# EAGLE board gmatrix (EAGLE 9.6.0)
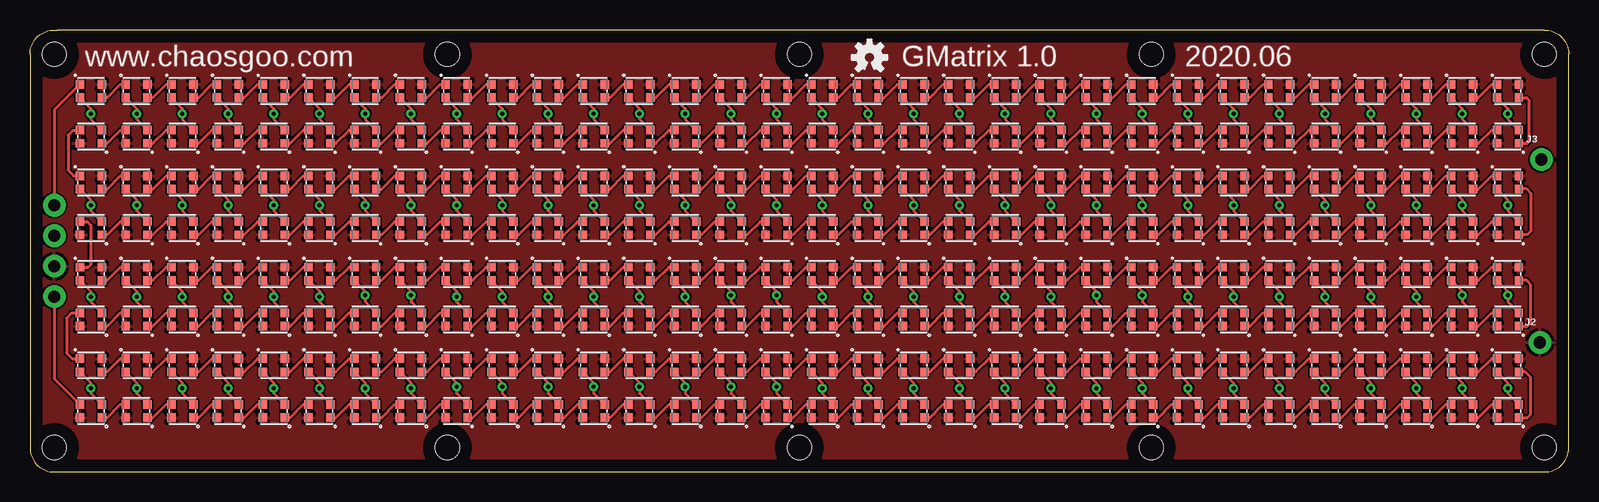
[diagram p3: board, top side]
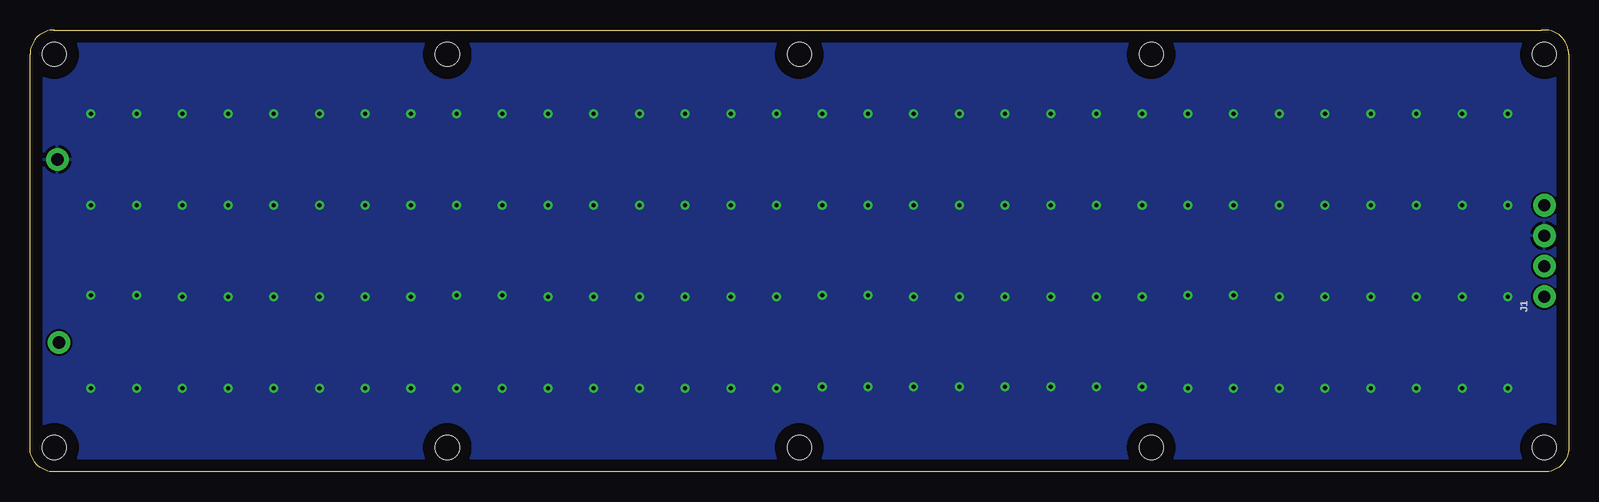
[diagram p4: board, bottom side, seen from below]

Size 128.27 x 36.83 mm. Coordinates in mm from the lower left corner, seen from the top.
Outline: 2.29,0 126.24,0 arc90 128.27,2.03 128.27,34.8 arc90 126.24,36.83 2.29,36.83 2.03,36.83 arc90 0,34.8 0,2.03 arc90 2.03,0 2.29,0
Copper layers (1*16): Top 0.035mm / dielectric 1.5mm / Bottom 0.035mm
Design rules "default": minimum track width 6mil, minimum drill 0.35mm, track to track 6mil, track to pad 6mil, pad to pad 6mil, via to via 6mil, smd to smd 6mil, copper to edge 40mil, drill to drill 6mil, minimum pad ring 10mil, minimum via ring 8mil, stop-mask expansion 4mil, vias tented up to drill 0mil, thermal gap 10mil
Holes 2 mm at 2.03,34.8 2.03,2.03 126.24,34.8 126.24,2.03 64.14,34.8 64.14,2.03 34.8,2.03 34.8,34.8 93.47,34.8 93.47,2.03

## Footprints (pad centres in the part's own frame; a part is rotated, then mirrored left to right if it is on the bottom)
1X04_NO_SILK = drill 1.016 pad 1.88: 1 0,0; 2 2.54,0; 3 5.08,0; 4 7.62,0
1X01NS_KIT = drill 1.016 pad 1.88: 1 0,0
WS2812-2020 = smd 0.7 x 0.7: 1 0.915,-0.55; 2 0.915,0.55; 3 -0.915,0.55; 4 -0.915,-0.55

## Placement (x,y rotation side)
J1  [1X04_NO_SILK]  2.03,14.61 90 bottom
J2  [1X01NS_KIT]  125.86,10.79 0 top
J3  [1X01NS_KIT]  125.98,26.04 0 top
U$1  WS2812-2020  [WS2812-2020]  5.08,5.08 0 top
U$2  WS2812-2020  [WS2812-2020]  8.89,5.08 0 top
U$3  WS2812-2020  [WS2812-2020]  12.7,5.08 0 top
U$4  WS2812-2020  [WS2812-2020]  16.51,5.08 0 top
U$5  WS2812-2020  [WS2812-2020]  20.32,5.08 0 top
U$6  WS2812-2020  [WS2812-2020]  24.13,5.08 0 top
U$7  WS2812-2020  [WS2812-2020]  27.94,5.08 0 top
U$8  WS2812-2020  [WS2812-2020]  31.75,5.08 0 top
U$9  WS2812-2020  [WS2812-2020]  35.56,5.08 0 top
U$10  WS2812-2020  [WS2812-2020]  39.37,5.08 0 top
U$11  WS2812-2020  [WS2812-2020]  43.18,5.08 0 top
U$12  WS2812-2020  [WS2812-2020]  46.99,5.08 0 top
U$13  WS2812-2020  [WS2812-2020]  50.8,5.08 0 top
U$14  WS2812-2020  [WS2812-2020]  54.61,5.08 0 top
U$15  WS2812-2020  [WS2812-2020]  58.42,5.08 0 top
U$16  WS2812-2020  [WS2812-2020]  62.23,5.08 0 top
U$17  WS2812-2020  [WS2812-2020]  66.04,5.08 0 top
U$18  WS2812-2020  [WS2812-2020]  69.85,5.08 0 top
U$19  WS2812-2020  [WS2812-2020]  73.66,5.08 0 top
U$20  WS2812-2020  [WS2812-2020]  77.47,5.08 0 top
U$21  WS2812-2020  [WS2812-2020]  81.28,5.08 0 top
U$22  WS2812-2020  [WS2812-2020]  85.09,5.08 0 top
U$23  WS2812-2020  [WS2812-2020]  88.9,5.08 0 top
U$24  WS2812-2020  [WS2812-2020]  92.71,5.08 0 top
U$25  WS2812-2020  [WS2812-2020]  96.52,5.08 0 top
U$26  WS2812-2020  [WS2812-2020]  100.33,5.08 0 top
U$27  WS2812-2020  [WS2812-2020]  104.14,5.08 0 top
U$28  WS2812-2020  [WS2812-2020]  107.95,5.08 0 top
U$29  WS2812-2020  [WS2812-2020]  111.76,5.08 0 top
U$30  WS2812-2020  [WS2812-2020]  115.57,5.08 0 top
U$31  WS2812-2020  [WS2812-2020]  119.38,5.08 0 top
U$32  WS2812-2020  [WS2812-2020]  123.19,5.08 0 top
U$33  WS2812-2020  [WS2812-2020]  123.19,8.89 180 top
U$34  WS2812-2020  [WS2812-2020]  119.38,8.89 180 top
U$35  WS2812-2020  [WS2812-2020]  115.57,8.89 180 top
U$36  WS2812-2020  [WS2812-2020]  111.76,8.89 180 top
U$37  WS2812-2020  [WS2812-2020]  107.95,8.89 180 top
U$38  WS2812-2020  [WS2812-2020]  104.14,8.89 180 top
U$39  WS2812-2020  [WS2812-2020]  100.33,8.89 180 top
U$40  WS2812-2020  [WS2812-2020]  96.52,8.89 180 top
U$41  WS2812-2020  [WS2812-2020]  92.71,8.89 180 top
U$42  WS2812-2020  [WS2812-2020]  88.9,8.89 180 top
U$43  WS2812-2020  [WS2812-2020]  85.09,8.89 180 top
U$44  WS2812-2020  [WS2812-2020]  81.28,8.89 180 top
U$45  WS2812-2020  [WS2812-2020]  77.47,8.89 180 top
U$46  WS2812-2020  [WS2812-2020]  73.66,8.89 180 top
U$47  WS2812-2020  [WS2812-2020]  69.85,8.89 180 top
U$48  WS2812-2020  [WS2812-2020]  66.04,8.89 180 top
U$49  WS2812-2020  [WS2812-2020]  62.23,8.89 180 top
U$50  WS2812-2020  [WS2812-2020]  58.42,8.89 180 top
U$51  WS2812-2020  [WS2812-2020]  54.61,8.89 180 top
U$52  WS2812-2020  [WS2812-2020]  50.8,8.89 180 top
U$53  WS2812-2020  [WS2812-2020]  46.99,8.89 180 top
U$54  WS2812-2020  [WS2812-2020]  43.18,8.89 180 top
U$55  WS2812-2020  [WS2812-2020]  39.37,8.89 180 top
U$56  WS2812-2020  [WS2812-2020]  35.56,8.89 180 top
U$57  WS2812-2020  [WS2812-2020]  31.75,8.89 180 top
U$58  WS2812-2020  [WS2812-2020]  27.94,8.89 180 top
U$59  WS2812-2020  [WS2812-2020]  24.13,8.89 180 top
U$60  WS2812-2020  [WS2812-2020]  20.32,8.89 180 top
U$61  WS2812-2020  [WS2812-2020]  16.51,8.89 180 top
U$62  WS2812-2020  [WS2812-2020]  12.7,8.89 180 top
U$63  WS2812-2020  [WS2812-2020]  8.89,8.89 180 top
U$64  WS2812-2020  [WS2812-2020]  5.08,8.89 180 top
U$65  WS2812-2020  [WS2812-2020]  5.08,12.7 0 top
U$66  WS2812-2020  [WS2812-2020]  8.89,12.7 0 top
U$67  WS2812-2020  [WS2812-2020]  12.7,12.7 0 top
U$68  WS2812-2020  [WS2812-2020]  16.51,12.7 0 top
U$69  WS2812-2020  [WS2812-2020]  20.32,12.7 0 top
U$70  WS2812-2020  [WS2812-2020]  24.13,12.7 0 top
U$71  WS2812-2020  [WS2812-2020]  27.94,12.7 0 top
U$72  WS2812-2020  [WS2812-2020]  31.75,12.7 0 top
U$73  WS2812-2020  [WS2812-2020]  35.56,12.7 0 top
U$74  WS2812-2020  [WS2812-2020]  39.37,12.7 0 top
U$75  WS2812-2020  [WS2812-2020]  43.18,12.7 0 top
U$76  WS2812-2020  [WS2812-2020]  46.99,12.7 0 top
U$77  WS2812-2020  [WS2812-2020]  50.8,12.7 0 top
U$78  WS2812-2020  [WS2812-2020]  54.61,12.7 0 top
U$79  WS2812-2020  [WS2812-2020]  58.42,12.7 0 top
U$80  WS2812-2020  [WS2812-2020]  62.23,12.7 0 top
U$81  WS2812-2020  [WS2812-2020]  66.04,12.7 0 top
U$82  WS2812-2020  [WS2812-2020]  69.85,12.7 0 top
U$83  WS2812-2020  [WS2812-2020]  73.66,12.7 0 top
U$84  WS2812-2020  [WS2812-2020]  77.47,12.7 0 top
U$85  WS2812-2020  [WS2812-2020]  81.28,12.7 0 top
U$86  WS2812-2020  [WS2812-2020]  85.09,12.7 0 top
U$87  WS2812-2020  [WS2812-2020]  88.9,12.7 0 top
U$88  WS2812-2020  [WS2812-2020]  92.71,12.7 0 top
U$89  WS2812-2020  [WS2812-2020]  96.52,12.7 0 top
U$90  WS2812-2020  [WS2812-2020]  100.33,12.7 0 top
U$91  WS2812-2020  [WS2812-2020]  104.14,12.7 0 top
U$92  WS2812-2020  [WS2812-2020]  107.95,12.7 0 top
U$93  WS2812-2020  [WS2812-2020]  111.76,12.7 0 top
U$94  WS2812-2020  [WS2812-2020]  115.57,12.7 0 top
U$95  WS2812-2020  [WS2812-2020]  119.38,12.7 0 top
U$96  WS2812-2020  [WS2812-2020]  123.19,12.7 0 top
U$97  WS2812-2020  [WS2812-2020]  123.19,16.51 180 top
U$98  WS2812-2020  [WS2812-2020]  119.38,16.51 180 top
U$99  WS2812-2020  [WS2812-2020]  115.57,16.51 180 top
U$100  WS2812-2020  [WS2812-2020]  111.76,16.51 180 top
U$101  WS2812-2020  [WS2812-2020]  107.95,16.51 180 top
U$102  WS2812-2020  [WS2812-2020]  104.14,16.51 180 top
U$103  WS2812-2020  [WS2812-2020]  100.33,16.51 180 top
U$104  WS2812-2020  [WS2812-2020]  96.52,16.51 180 top
U$105  WS2812-2020  [WS2812-2020]  92.71,16.51 180 top
U$106  WS2812-2020  [WS2812-2020]  88.9,16.51 180 top
U$107  WS2812-2020  [WS2812-2020]  85.09,16.51 180 top
U$108  WS2812-2020  [WS2812-2020]  81.28,16.51 180 top
U$109  WS2812-2020  [WS2812-2020]  77.47,16.51 180 top
U$110  WS2812-2020  [WS2812-2020]  73.66,16.51 180 top
U$111  WS2812-2020  [WS2812-2020]  69.85,16.51 180 top
U$112  WS2812-2020  [WS2812-2020]  66.04,16.51 180 top
U$113  WS2812-2020  [WS2812-2020]  62.23,16.51 180 top
U$114  WS2812-2020  [WS2812-2020]  58.42,16.51 180 top
U$115  WS2812-2020  [WS2812-2020]  54.61,16.51 180 top
U$116  WS2812-2020  [WS2812-2020]  50.8,16.51 180 top
U$117  WS2812-2020  [WS2812-2020]  46.99,16.51 180 top
U$118  WS2812-2020  [WS2812-2020]  43.18,16.51 180 top
U$119  WS2812-2020  [WS2812-2020]  39.37,16.51 180 top
U$120  WS2812-2020  [WS2812-2020]  35.56,16.51 180 top
U$121  WS2812-2020  [WS2812-2020]  31.75,16.51 180 top
U$122  WS2812-2020  [WS2812-2020]  27.94,16.51 180 top
U$123  WS2812-2020  [WS2812-2020]  24.13,16.51 180 top
U$124  WS2812-2020  [WS2812-2020]  20.32,16.51 180 top
U$125  WS2812-2020  [WS2812-2020]  16.51,16.51 180 top
U$126  WS2812-2020  [WS2812-2020]  12.7,16.51 180 top
U$127  WS2812-2020  [WS2812-2020]  8.89,16.51 180 top
U$128  WS2812-2020  [WS2812-2020]  5.08,16.51 180 top
U$129  WS2812-2020  [WS2812-2020]  5.08,20.32 0 top
U$130  WS2812-2020  [WS2812-2020]  8.89,20.32 0 top
U$131  WS2812-2020  [WS2812-2020]  12.7,20.32 0 top
U$132  WS2812-2020  [WS2812-2020]  16.51,20.32 0 top
U$133  WS2812-2020  [WS2812-2020]  20.32,20.32 0 top
U$134  WS2812-2020  [WS2812-2020]  24.13,20.32 0 top
U$135  WS2812-2020  [WS2812-2020]  27.94,20.32 0 top
U$136  WS2812-2020  [WS2812-2020]  31.75,20.32 0 top
U$137  WS2812-2020  [WS2812-2020]  35.56,20.32 0 top
U$138  WS2812-2020  [WS2812-2020]  39.37,20.32 0 top
U$139  WS2812-2020  [WS2812-2020]  43.18,20.32 0 top
U$140  WS2812-2020  [WS2812-2020]  46.99,20.32 0 top
U$141  WS2812-2020  [WS2812-2020]  50.8,20.32 0 top
U$142  WS2812-2020  [WS2812-2020]  54.61,20.32 0 top
U$143  WS2812-2020  [WS2812-2020]  58.42,20.32 0 top
U$144  WS2812-2020  [WS2812-2020]  62.23,20.32 0 top
U$145  WS2812-2020  [WS2812-2020]  66.04,20.32 0 top
U$146  WS2812-2020  [WS2812-2020]  69.85,20.32 0 top
U$147  WS2812-2020  [WS2812-2020]  73.66,20.32 0 top
U$148  WS2812-2020  [WS2812-2020]  77.47,20.32 0 top
U$149  WS2812-2020  [WS2812-2020]  81.28,20.32 0 top
U$150  WS2812-2020  [WS2812-2020]  85.09,20.32 0 top
U$151  WS2812-2020  [WS2812-2020]  88.9,20.32 0 top
U$152  WS2812-2020  [WS2812-2020]  92.71,20.32 0 top
U$153  WS2812-2020  [WS2812-2020]  96.52,20.32 0 top
U$154  WS2812-2020  [WS2812-2020]  100.33,20.32 0 top
U$155  WS2812-2020  [WS2812-2020]  104.14,20.32 0 top
U$156  WS2812-2020  [WS2812-2020]  107.95,20.32 0 top
U$157  WS2812-2020  [WS2812-2020]  111.76,20.32 0 top
U$158  WS2812-2020  [WS2812-2020]  115.57,20.32 0 top
U$159  WS2812-2020  [WS2812-2020]  119.38,20.32 0 top
U$160  WS2812-2020  [WS2812-2020]  123.19,20.32 0 top
U$161  WS2812-2020  [WS2812-2020]  123.19,24.13 180 top
U$162  WS2812-2020  [WS2812-2020]  119.38,24.13 180 top
U$163  WS2812-2020  [WS2812-2020]  115.57,24.13 180 top
U$164  WS2812-2020  [WS2812-2020]  111.76,24.13 180 top
U$165  WS2812-2020  [WS2812-2020]  107.95,24.13 180 top
U$166  WS2812-2020  [WS2812-2020]  104.14,24.13 180 top
U$167  WS2812-2020  [WS2812-2020]  100.33,24.13 180 top
U$168  WS2812-2020  [WS2812-2020]  96.52,24.13 180 top
U$169  WS2812-2020  [WS2812-2020]  92.71,24.13 180 top
U$170  WS2812-2020  [WS2812-2020]  88.9,24.13 180 top
U$171  WS2812-2020  [WS2812-2020]  85.09,24.13 180 top
U$172  WS2812-2020  [WS2812-2020]  81.28,24.13 180 top
U$173  WS2812-2020  [WS2812-2020]  77.47,24.13 180 top
U$174  WS2812-2020  [WS2812-2020]  73.66,24.13 180 top
U$175  WS2812-2020  [WS2812-2020]  69.85,24.13 180 top
U$176  WS2812-2020  [WS2812-2020]  66.04,24.13 180 top
U$177  WS2812-2020  [WS2812-2020]  62.23,24.13 180 top
U$178  WS2812-2020  [WS2812-2020]  58.42,24.13 180 top
U$179  WS2812-2020  [WS2812-2020]  54.61,24.13 180 top
U$180  WS2812-2020  [WS2812-2020]  50.8,24.13 180 top
U$181  WS2812-2020  [WS2812-2020]  46.99,24.13 180 top
U$182  WS2812-2020  [WS2812-2020]  43.18,24.13 180 top
U$183  WS2812-2020  [WS2812-2020]  39.37,24.13 180 top
U$184  WS2812-2020  [WS2812-2020]  35.56,24.13 180 top
U$185  WS2812-2020  [WS2812-2020]  31.75,24.13 180 top
U$186  WS2812-2020  [WS2812-2020]  27.94,24.13 180 top
U$187  WS2812-2020  [WS2812-2020]  24.13,24.13 180 top
U$188  WS2812-2020  [WS2812-2020]  20.32,24.13 180 top
U$189  WS2812-2020  [WS2812-2020]  16.51,24.13 180 top
U$190  WS2812-2020  [WS2812-2020]  12.7,24.13 180 top
U$191  WS2812-2020  [WS2812-2020]  8.89,24.13 180 top
U$192  WS2812-2020  [WS2812-2020]  5.08,24.13 180 top
U$193  WS2812-2020  [WS2812-2020]  5.08,27.94 0 top
U$194  WS2812-2020  [WS2812-2020]  8.89,27.94 0 top
U$195  WS2812-2020  [WS2812-2020]  12.7,27.94 0 top
U$196  WS2812-2020  [WS2812-2020]  16.51,27.94 0 top
U$197  WS2812-2020  [WS2812-2020]  20.32,27.94 0 top
U$198  WS2812-2020  [WS2812-2020]  24.13,27.94 0 top
U$199  WS2812-2020  [WS2812-2020]  27.94,27.94 0 top
U$200  WS2812-2020  [WS2812-2020]  31.75,27.94 0 top
U$201  WS2812-2020  [WS2812-2020]  35.56,27.94 0 top
U$202  WS2812-2020  [WS2812-2020]  39.37,27.94 0 top
U$203  WS2812-2020  [WS2812-2020]  43.18,27.94 0 top
U$204  WS2812-2020  [WS2812-2020]  46.99,27.94 0 top
U$205  WS2812-2020  [WS2812-2020]  50.8,27.94 0 top
U$206  WS2812-2020  [WS2812-2020]  54.61,27.94 0 top
U$207  WS2812-2020  [WS2812-2020]  58.42,27.94 0 top
U$208  WS2812-2020  [WS2812-2020]  62.23,27.94 0 top
U$209  WS2812-2020  [WS2812-2020]  66.04,27.94 0 top
U$210  WS2812-2020  [WS2812-2020]  69.85,27.94 0 top
U$211  WS2812-2020  [WS2812-2020]  73.66,27.94 0 top
U$212  WS2812-2020  [WS2812-2020]  77.47,27.94 0 top
U$213  WS2812-2020  [WS2812-2020]  81.28,27.94 0 top
U$214  WS2812-2020  [WS2812-2020]  85.09,27.94 0 top
U$215  WS2812-2020  [WS2812-2020]  88.9,27.94 0 top
U$216  WS2812-2020  [WS2812-2020]  92.71,27.94 0 top
U$217  WS2812-2020  [WS2812-2020]  96.52,27.94 0 top
U$218  WS2812-2020  [WS2812-2020]  100.33,27.94 0 top
U$219  WS2812-2020  [WS2812-2020]  104.14,27.94 0 top
U$220  WS2812-2020  [WS2812-2020]  107.95,27.94 0 top
U$221  WS2812-2020  [WS2812-2020]  111.76,27.94 0 top
U$222  WS2812-2020  [WS2812-2020]  115.57,27.94 0 top
U$223  WS2812-2020  [WS2812-2020]  119.38,27.94 0 top
U$224  WS2812-2020  [WS2812-2020]  123.19,27.94 0 top
U$225  WS2812-2020  [WS2812-2020]  123.19,31.75 180 top
U$226  WS2812-2020  [WS2812-2020]  119.38,31.75 180 top
U$227  WS2812-2020  [WS2812-2020]  115.57,31.75 180 top
U$228  WS2812-2020  [WS2812-2020]  111.76,31.75 180 top
U$229  WS2812-2020  [WS2812-2020]  107.95,31.75 180 top
U$230  WS2812-2020  [WS2812-2020]  104.14,31.75 180 top
U$231  WS2812-2020  [WS2812-2020]  100.33,31.75 180 top
U$232  WS2812-2020  [WS2812-2020]  96.52,31.75 180 top
U$233  WS2812-2020  [WS2812-2020]  92.71,31.75 180 top
U$234  WS2812-2020  [WS2812-2020]  88.9,31.75 180 top
U$235  WS2812-2020  [WS2812-2020]  85.09,31.75 180 top
U$236  WS2812-2020  [WS2812-2020]  81.28,31.75 180 top
U$237  WS2812-2020  [WS2812-2020]  77.47,31.75 180 top
U$238  WS2812-2020  [WS2812-2020]  73.66,31.75 180 top
U$239  WS2812-2020  [WS2812-2020]  69.85,31.75 180 top
U$240  WS2812-2020  [WS2812-2020]  66.04,31.75 180 top
U$241  WS2812-2020  [WS2812-2020]  62.23,31.75 180 top
U$242  WS2812-2020  [WS2812-2020]  58.42,31.75 180 top
U$243  WS2812-2020  [WS2812-2020]  54.61,31.75 180 top
U$244  WS2812-2020  [WS2812-2020]  50.8,31.75 180 top
U$245  WS2812-2020  [WS2812-2020]  46.99,31.75 180 top
U$246  WS2812-2020  [WS2812-2020]  43.18,31.75 180 top
U$247  WS2812-2020  [WS2812-2020]  39.37,31.75 180 top
U$248  WS2812-2020  [WS2812-2020]  35.56,31.75 180 top
U$249  WS2812-2020  [WS2812-2020]  31.75,31.75 180 top
U$250  WS2812-2020  [WS2812-2020]  27.94,31.75 180 top
U$251  WS2812-2020  [WS2812-2020]  24.13,31.75 180 top
U$252  WS2812-2020  [WS2812-2020]  20.32,31.75 180 top
U$253  WS2812-2020  [WS2812-2020]  16.51,31.75 180 top
U$254  WS2812-2020  [WS2812-2020]  12.7,31.75 180 top
U$255  WS2812-2020  [WS2812-2020]  8.89,31.75 180 top
U$256  WS2812-2020  [WS2812-2020]  5.08,31.75 180 top
U$257  [OSHW-LOGO-S]  69.98,34.54 0 top

## Tracks (layer width: path | path; a pad name or v marks a point on that pad's centre or on a via)
DI
  Top 0.254: J1.1 2.03,7.76 U$1.3
DO
  Top 0.254: U$256.1 2.03,30.17 J1.4
GND  (via drill 0.35)
  Top 0.254: U$256.2 5.08,30.29 v5.08,29.84 5.08,29.41 U$193.2 | U$255.2 8.89,30.29 v8.89,29.84 8.89,29.41 U$194.2 | U$254.2 12.7,30.29 v12.7,29.84 12.7,29.41 U$195.2 | U$253.2 16.51,30.29 v16.51,29.84 16.51,29.41 U$196.2 | U$225.2 123.19,30.29 v123.19,29.84 123.19,29.41 U$224.2 | U$226.2 119.38,30.29 v119.38,29.84 119.38,29.41 U$223.2 | U$227.2 115.57,30.29 v115.57,29.84 115.57,29.41 U$222.2 | U$228.2 111.76,30.29 v111.76,29.84 111.76,29.41 U$221.2 | U$229.2 107.95,30.29 v107.95,29.84 107.95,29.41 U$220.2 | U$230.2 104.14,30.29 v104.14,29.84 104.14,29.41 U$219.2 | U$231.2 100.33,30.29 v100.33,29.84 100.33,29.41 U$218.2 | U$232.2 96.52,30.29 v96.52,29.84 96.52,29.41 U$217.2 | U$233.2 92.71,30.29 v92.71,29.84 92.71,29.41 U$216.2 | U$234.2 88.9,30.29 v88.9,29.84 88.9,29.41 U$215.2 | U$235.2 85.09,30.29 v85.09,29.84 85.09,29.41 U$214.2 | U$236.2 81.28,30.29 v81.28,29.84 81.28,29.41 U$213.2 | U$237.2 77.47,30.29 v77.47,29.84 77.47,29.41 U$212.2 | U$238.2 73.66,30.29 v73.66,29.84 73.66,29.41 U$211.2 | U$239.2 69.85,30.29 v69.85,29.84 69.85,29.41 U$210.2 | U$240.2 66.04,30.29 v66.04,29.84 66.04,29.41 U$209.2 | U$241.2 62.23,30.29 v62.23,29.84 62.23,29.41 U$208.2 | U$242.2 58.42,30.29 v58.42,29.84 58.42,29.41 U$207.2 | U$243.2 54.61,30.29 v54.61,29.84 54.61,29.41 U$206.2 | U$244.2 50.8,30.29 v50.8,29.84 50.8,29.41 U$205.2 | U$245.2 46.99,30.29 v46.99,29.84 46.99,29.41 U$204.2 | U$246.2 43.18,30.29 v43.18,29.84 43.18,29.41 U$203.2 | U$247.2 39.37,30.29 v39.37,29.84 39.37,29.41 U$202.2 | U$248.2 35.56,30.29 v35.56,29.84 35.56,29.41 U$201.2 | U$249.2 31.75,30.29 v31.75,29.84 31.75,29.41 U$200.2
  Top 0.254: U$250.2 27.94,30.29 v27.94,29.84 27.94,29.41 U$199.2 | U$251.2 24.13,30.29 v24.13,29.84 24.13,29.41 U$198.2 | U$252.2 20.32,30.29 v20.32,29.84 20.32,29.41 U$197.2 | U$192.2 5.08,22.66 v5.08,22.23 5.08,21.79 U$129.2 | U$191.2 8.89,22.66 v8.89,22.23 8.89,21.79 U$130.2 | U$190.2 12.7,22.66 v12.7,22.23 12.7,21.79 U$131.2 | U$189.2 16.51,22.66 v16.51,22.23 16.51,21.79 U$132.2 | U$188.2 20.32,22.66 v20.32,22.23 20.32,21.79 U$133.2 | U$187.2 24.13,22.66 v24.13,22.23 24.13,21.79 U$134.2 | U$186.2 27.94,22.66 v27.94,22.23 27.94,21.79 U$135.2 | U$185.2 31.75,22.66 v31.75,22.23 31.75,21.79 U$136.2 | U$184.2 35.56,22.66 v35.56,22.23 35.56,21.79 U$137.2 | U$183.2 39.37,22.66 v39.37,22.23 39.37,21.79 U$138.2 | U$182.2 43.18,22.66 v43.18,22.23 43.18,21.79 U$139.2 | U$181.2 46.99,22.66 v46.99,22.23 46.99,21.79 U$140.2 | U$180.2 50.8,22.66 v50.8,22.23 50.8,21.79 U$141.2 | U$179.2 54.61,22.66 v54.61,22.23 54.61,21.79 U$142.2 | U$178.2 58.42,22.66 v58.42,22.23 58.42,21.79 U$143.2 | U$177.2 62.23,22.66 v62.23,22.23 62.23,21.79 U$144.2 | U$176.2 66.04,22.66 v66.04,22.23 66.04,21.79 U$145.2 | U$175.2 69.85,22.66 v69.85,22.23 69.85,21.79 U$146.2 | U$174.2 73.66,22.66 v73.66,22.23 73.66,21.79 U$147.2 | U$173.2 77.47,22.66 v77.47,22.23 77.47,21.79 U$148.2 | U$172.2 81.28,22.66 v81.28,22.23 81.28,21.79 U$149.2 | U$171.2 85.09,22.66 v85.09,22.23 85.09,21.79 U$150.2 | U$170.2 88.9,22.66 v88.9,22.23 88.9,21.79 U$151.2 | U$169.2 92.71,22.66 v92.71,22.23 92.71,21.79 U$152.2 | U$168.2 96.52,22.66 v96.52,22.23 96.52,21.79 U$153.2 | U$167.2 100.33,22.66 v100.33,22.23 100.33,21.79 U$154.2 | U$166.2 104.14,22.66 v104.14,22.23 104.14,21.79 U$155.2
  Top 0.254: U$165.2 107.95,22.66 v107.95,22.23 107.95,21.79 U$156.2 | U$164.2 111.76,22.66 v111.76,22.23 111.76,21.79 U$157.2 | U$163.2 115.57,22.66 v115.57,22.23 115.57,21.79 U$158.2 | U$162.2 119.38,22.66 v119.38,22.23 119.38,21.79 U$159.2 | U$161.2 123.19,22.66 v123.19,22.23 123.19,21.79 U$160.2 | U$128.2 5.08,15.04 v5.08,14.61 5.08,14.16 U$65.2 | U$127.2 8.89,15.04 v8.89,14.61 8.89,14.16 U$66.2 | U$126.2 12.7,15.04 v12.7,14.61 12.7,14.16 U$67.2 | U$125.2 16.51,15.04 v16.51,14.61 16.51,14.16 U$68.2 | U$124.2 20.32,15.04 v20.32,14.61 20.32,14.16 U$69.2 | U$123.2 24.13,15.04 v24.13,14.61 24.13,14.16 U$70.2 | U$122.2 27.94,15.04 v27.94,14.73 27.94,14.16 U$71.2 | U$121.2 31.75,15.04 v31.75,14.73 31.75,14.16 U$72.2 | U$120.2 35.56,15.04 v35.56,14.61 35.56,14.16 U$73.2 | U$119.2 39.37,15.04 v39.37,14.61 39.37,14.16 U$74.2 | U$118.2 43.18,15.04 v43.18,14.61 43.18,14.16 U$75.2 | U$117.2 46.99,15.04 v46.99,14.61 46.99,14.16 U$76.2 | U$116.2 50.8,15.04 v50.8,14.61 50.8,14.16 U$77.2 | U$115.2 54.61,15.04 v54.61,14.61 54.61,14.16 U$78.2 | U$114.2 58.42,15.04 v58.42,14.73 58.42,14.16 U$79.2 | U$113.2 62.23,15.04 v62.23,14.73 62.23,14.16 U$80.2 | U$112.2 66.04,15.04 v66.04,14.61 66.04,14.16 U$81.2 | U$111.2 69.85,15.04 v69.85,14.61 69.85,14.16 U$82.2 | U$110.2 73.66,15.04 v73.66,14.61 73.66,14.16 U$83.2 | U$109.2 77.47,15.04 v77.47,14.61 77.47,14.16 U$84.2 | U$108.2 81.28,15.04 v81.28,14.61 81.28,14.16 U$85.2 | U$107.2 85.09,15.04 v85.09,14.61 85.09,14.16 U$86.2 | U$106.2 88.9,15.04 v88.9,14.73 88.9,14.16 U$87.2 | U$105.2 92.71,15.04 v92.71,14.73 92.71,14.16 U$88.2 | U$104.2 96.52,15.04 v96.52,14.61 96.52,14.16 U$89.2
  Top 0.254: U$103.2 100.33,15.04 v100.33,14.61 100.33,14.16 U$90.2 | U$102.2 104.14,15.04 v104.14,14.61 104.14,14.16 U$91.2 | U$101.2 107.95,15.04 v107.95,14.61 107.95,14.16 U$92.2 | U$100.2 111.76,15.04 v111.76,14.61 111.76,14.16 U$93.2 | U$99.2 115.57,15.04 v115.57,14.61 115.57,14.16 U$94.2 | U$98.2 119.38,15.04 v119.38,14.73 119.38,14.16 U$95.2 | U$97.2 123.19,15.04 v123.19,14.73 123.19,14.16 U$96.2 | U$64.2 5.08,7.42 v5.08,6.99 5.08,6.54 U$1.2 | U$63.2 8.89,7.42 v8.89,6.99 8.89,6.54 U$2.2 | U$62.2 12.7,7.42 v12.7,6.99 12.7,6.54 U$3.2 | U$61.2 16.51,7.42 v16.51,6.99 16.51,6.54 U$4.2 | U$60.2 20.32,7.42 v20.32,6.99 20.32,6.54 U$5.2 | U$59.2 24.13,7.42 v24.13,6.99 24.13,6.54 U$6.2 | U$58.2 27.94,7.42 v27.94,6.99 27.94,6.54 U$7.2 | U$57.2 31.75,7.42 v31.75,6.99 31.75,6.54 U$8.2 | U$56.2 35.56,7.42 v35.56,7.11 35.56,6.54 U$9.2 | U$55.2 39.37,7.42 v39.37,7.11 39.37,6.54 U$10.2 | U$54.2 43.18,7.42 v43.18,7.11 43.18,6.54 U$11.2 | U$53.2 46.99,7.42 v46.99,7.11 46.99,6.54 U$12.2 | U$52.2 50.8,7.42 v50.8,7.11 50.8,6.54 U$13.2 | U$51.2 54.61,7.42 v54.61,7.11 54.61,6.54 U$14.2 | U$50.2 58.42,7.42 v58.42,7.11 58.42,6.54 U$15.2 | U$49.2 62.23,7.42 v62.23,7.11 62.23,6.54 U$16.2 | U$48.2 66.04,7.42 v66.04,6.99 66.04,6.54 U$17.2 | U$47.2 69.85,7.42 v69.85,6.99 69.85,6.54 U$18.2 | U$46.2 73.66,7.42 v73.66,6.99 73.66,6.54 U$19.2 | U$45.2 77.47,7.42 v77.47,6.99 77.47,6.54 U$20.2 | U$44.2 81.28,7.42 v81.28,6.99 81.28,6.54 U$21.2 | U$43.2 85.09,7.42 v85.09,6.99 85.09,6.54 U$22.2 | U$42.2 88.9,7.42 v88.9,6.99 88.9,6.54 U$23.2 | U$41.2 92.71,7.42 v92.71,6.99 92.71,6.54 U$24.2 | U$40.2 96.52,7.42 v96.52,6.99 96.52,6.54 U$25.2
  Top 0.254: U$39.2 100.33,7.42 v100.33,6.99 100.33,6.54 U$26.2 | U$38.2 104.14,7.42 v104.14,6.99 104.14,6.54 U$27.2 | U$37.2 107.95,7.42 v107.95,6.99 107.95,6.54 U$28.2 | U$36.2 111.76,7.42 v111.76,6.99 111.76,6.54 U$29.2 | U$35.2 115.57,7.42 v115.57,6.99 115.57,6.54 U$30.2 | U$34.2 119.38,7.42 v119.38,6.99 119.38,6.54 U$31.2 | U$33.2 123.19,7.42 v123.19,6.99 123.19,6.54 U$32.2
  pour Bottom: -4.06,39.62 -4.06,-1.02 -2.79,-2.29 130.56,-2.29 130.56,38.1 -2.54,38.1
N$1
  Top 0.254: U$1.1 6.43,4.53 7.54,5.63 U$2.3
N$2
  Top 0.254: U$2.1 10.24,4.53 11.35,5.63 U$3.3
N$3
  Top 0.254: U$3.1 14.05,4.53 15.15,5.63 U$4.3
N$4
  Top 0.254: U$4.1 17.86,4.53 18.96,5.63 U$5.3
N$5
  Top 0.254: U$5.1 21.68,4.53 22.77,5.63 U$6.3
N$6
  Top 0.254: U$6.1 25.48,4.53 26.59,5.63 U$7.3
N$7
  Top 0.254: U$7.1 29.3,4.53 30.39,5.63 U$8.3
N$8
  Top 0.254: U$8.1 33.1,4.53 34.2,5.63 U$9.3
N$9
  Top 0.254: U$9.1 36.91,4.53 38.02,5.63 U$10.3
N$10
  Top 0.254: U$10.1 40.73,4.53 41.83,5.63 U$11.3
N$11
  Top 0.254: U$11.1 44.53,4.53 45.63,5.63 U$12.3
N$12
  Top 0.254: U$12.1 48.34,4.53 49.45,5.63 U$13.3
N$13
  Top 0.254: U$13.1 52.16,4.53 53.26,5.63 U$14.3
N$14
  Top 0.254: U$14.1 55.97,4.53 57.06,5.63 U$15.3
N$15
  Top 0.254: U$15.1 59.77,4.53 60.88,5.63 U$16.3
N$16
  Top 0.254: U$16.1 63.59,4.53 64.69,5.63 U$17.3
N$17
  Top 0.254: U$17.1 67.39,4.53 68.5,5.63 U$18.3
N$18
  Top 0.254: U$18.1 71.2,4.53 72.31,5.63 U$19.3
N$19
  Top 0.254: U$19.1 75.02,4.53 76.11,5.63 U$20.3
N$20
  Top 0.254: U$20.1 78.83,4.53 79.92,5.63 U$21.3
N$21
  Top 0.254: U$21.1 82.64,4.53 83.73,5.63 U$22.3
N$22
  Top 0.254: U$22.1 86.44,4.53 87.55,5.63 U$23.3
N$23
  Top 0.254: U$23.1 90.25,4.53 91.36,5.63 U$24.3
N$24
  Top 0.254: U$24.1 94.06,4.53 95.17,5.63 U$25.3
N$25
  Top 0.254: U$25.1 97.88,4.53 98.97,5.63 U$26.3
N$26
  Top 0.254: U$26.1 101.69,4.53 102.78,5.63 U$27.3
N$27
  Top 0.254: U$27.1 105.5,4.53 106.59,5.63 U$28.3
N$28
  Top 0.254: U$28.1 109.31,4.53 110.41,5.63 U$29.3
N$29
  Top 0.254: U$29.1 113.11,4.53 114.22,5.63 U$30.3
N$30
  Top 0.254: U$30.1 116.92,4.53 118.03,5.63 U$31.3
N$31
  Top 0.254: U$31.1 120.73,4.53 121.83,5.63 U$32.3
N$32
  Top 0.254: U$34.3 120.73,8.34 121.83,9.44 U$33.1
N$33
  Top 0.254: U$35.3 116.92,8.34 118.03,9.44 U$34.1
N$34
  Top 0.254: U$36.3 113.11,8.34 114.22,9.44 U$35.1
N$35
  Top 0.254: U$37.3 109.31,8.34 110.41,9.44 U$36.1
N$36
  Top 0.254: U$38.3 105.5,8.34 106.59,9.44 U$37.1
N$37
  Top 0.254: U$39.3 101.69,8.34 102.78,9.44 U$38.1
N$38
  Top 0.254: U$40.3 97.88,8.34 98.97,9.44 U$39.1
N$39
  Top 0.254: U$41.3 94.06,8.34 95.17,9.44 U$40.1
N$40
  Top 0.254: U$42.3 90.25,8.34 91.36,9.44 U$41.1
N$41
  Top 0.254: U$43.3 86.44,8.34 87.55,9.44 U$42.1
N$42
  Top 0.254: U$44.3 82.64,8.34 83.73,9.44 U$43.1
N$43
  Top 0.254: U$45.3 78.83,8.34 79.92,9.44 U$44.1
N$44
  Top 0.254: U$46.3 75.02,8.34 76.11,9.44 U$45.1
N$45
  Top 0.254: U$47.3 71.2,8.34 72.31,9.44 U$46.1
N$46
  Top 0.254: U$48.3 67.39,8.34 68.5,9.44 U$47.1
N$47
  Top 0.254: U$49.3 63.59,8.34 64.69,9.44 U$48.1
N$48
  Top 0.254: U$50.3 59.77,8.34 60.88,9.44 U$49.1
N$49
  Top 0.254: U$51.3 55.97,8.34 57.06,9.44 U$50.1
N$50
  Top 0.254: U$52.3 52.16,8.34 53.26,9.44 U$51.1
N$51
  Top 0.254: U$53.3 48.34,8.34 49.45,9.44 U$52.1
N$52
  Top 0.254: U$54.3 44.53,8.34 45.63,9.44 U$53.1
N$53
  Top 0.254: U$55.3 40.73,8.34 41.83,9.44 U$54.1
N$54
  Top 0.254: U$56.3 36.91,8.34 38.02,9.44 U$55.1
N$55
  Top 0.254: U$57.3 33.1,8.34 34.2,9.44 U$56.1
N$56
  Top 0.254: U$58.3 29.3,8.34 30.39,9.44 U$57.1
N$57
  Top 0.254: U$59.3 25.48,8.34 26.59,9.44 U$58.1
N$58
  Top 0.254: U$60.3 21.68,8.34 22.77,9.44 U$59.1
N$59
  Top 0.254: U$61.3 17.86,8.34 18.96,9.44 U$60.1
N$60
  Top 0.254: U$62.3 14.05,8.34 15.15,9.44 U$61.1
N$61
  Top 0.254: U$63.3 10.24,8.34 11.35,9.44 U$62.1
N$62
  Top 0.254: U$64.3 6.04,8.38 6.48,8.38 7.54,9.44 U$63.1
N$63
  Top 0.254: U$65.1 6.43,12.15 7.54,13.25 U$66.3
N$64
  Top 0.254: U$66.1 10.24,12.15 11.35,13.25 U$67.3
N$65
  Top 0.254: U$67.1 14.05,12.15 15.15,13.25 U$68.3
N$66
  Top 0.254: U$68.1 17.86,12.15 18.96,13.25 U$69.3
N$67
  Top 0.254: U$69.1 21.68,12.15 22.77,13.25 U$70.3
N$68
  Top 0.254: U$70.1 25.48,12.15 26.59,13.25 U$71.3
N$69
  Top 0.254: U$71.1 29.3,12.15 30.39,13.25 U$72.3
N$70
  Top 0.254: U$72.1 33.1,12.15 34.2,13.25 U$73.3
N$71
  Top 0.254: U$73.1 36.91,12.15 38.02,13.25 U$74.3
N$72
  Top 0.254: U$74.1 40.73,12.15 41.83,13.25 U$75.3
N$73
  Top 0.254: U$75.1 44.53,12.15 45.63,13.25 U$76.3
N$74
  Top 0.254: U$76.1 48.34,12.15 49.45,13.25 U$77.3
N$75
  Top 0.254: U$77.1 52.16,12.15 53.26,13.25 U$78.3
N$76
  Top 0.254: U$78.1 55.97,12.15 57.06,13.25 U$79.3
N$77
  Top 0.254: U$79.1 59.77,12.15 60.88,13.25 U$80.3
N$78
  Top 0.254: U$80.1 63.59,12.15 64.69,13.25 U$81.3
N$79
  Top 0.254: U$81.1 67.39,12.15 68.5,13.25 U$82.3
N$80
  Top 0.254: U$82.1 71.2,12.15 72.31,13.25 U$83.3
N$81
  Top 0.254: U$83.1 75.02,12.15 76.11,13.25 U$84.3
N$82
  Top 0.254: U$84.1 78.83,12.15 79.92,13.25 U$85.3
N$83
  Top 0.254: U$85.1 82.64,12.15 83.73,13.25 U$86.3
N$84
  Top 0.254: U$86.1 86.44,12.15 87.55,13.25 U$87.3
N$85
  Top 0.254: U$87.1 90.25,12.15 91.36,13.25 U$88.3
N$86
  Top 0.254: U$88.1 94.06,12.15 95.17,13.25 U$89.3
N$87
  Top 0.254: U$89.1 97.88,12.15 98.97,13.25 U$90.3
N$88
  Top 0.254: U$90.1 101.69,12.15 102.78,13.25 U$91.3
N$89
  Top 0.254: U$91.1 105.5,12.15 106.59,13.25 U$92.3
N$90
  Top 0.254: U$92.1 109.31,12.15 110.41,13.25 U$93.3
N$91
  Top 0.254: U$93.1 113.11,12.15 114.22,13.25 U$94.3
N$92
  Top 0.254: U$94.1 116.92,12.15 118.03,13.25 U$95.3
N$93
  Top 0.254: U$95.1 120.73,12.15 121.83,13.25 U$96.3
N$94
  Top 0.254: U$98.3 120.73,15.96 121.83,17.06 U$97.1
N$95
  Top 0.254: U$99.3 116.92,15.96 118.03,17.06 U$98.1
N$96
  Top 0.254: U$100.3 113.11,15.96 114.22,17.06 U$99.1
N$97
  Top 0.254: U$101.3 109.31,15.96 110.41,17.06 U$100.1
N$98
  Top 0.254: U$102.3 105.5,15.96 106.59,17.06 U$101.1
N$99
  Top 0.254: U$103.3 101.69,15.96 102.78,17.06 U$102.1
N$100
  Top 0.254: U$104.3 97.88,15.96 98.97,17.06 U$103.1
N$101
  Top 0.254: U$105.3 94.06,15.96 95.17,17.06 U$104.1
N$102
  Top 0.254: U$106.3 90.25,15.96 91.36,17.06 U$105.1
N$103
  Top 0.254: U$107.3 86.44,15.96 87.55,17.06 U$106.1
N$104
  Top 0.254: U$108.3 82.64,15.96 83.73,17.06 U$107.1
N$105
  Top 0.254: U$109.3 78.83,15.96 79.92,17.06 U$108.1
N$106
  Top 0.254: U$110.3 75.02,15.96 76.11,17.06 U$109.1
N$107
  Top 0.254: U$111.3 71.2,15.96 72.31,17.06 U$110.1
N$108
  Top 0.254: U$112.3 67.39,15.96 68.5,17.06 U$111.1
N$109
  Top 0.254: U$113.3 63.59,15.96 64.69,17.06 U$112.1
N$110
  Top 0.254: U$114.3 59.77,15.96 60.88,17.06 U$113.1
N$111
  Top 0.254: U$115.3 55.97,15.96 57.06,17.06 U$114.1
N$112
  Top 0.254: U$116.3 52.16,15.96 53.26,17.06 U$115.1
N$113
  Top 0.254: U$117.3 48.34,15.96 49.45,17.06 U$116.1
N$114
  Top 0.254: U$118.3 44.53,15.96 45.63,17.06 U$117.1
N$115
  Top 0.254: U$119.3 40.73,15.96 41.83,17.06 U$118.1
N$116
  Top 0.254: U$120.3 36.91,15.96 38.02,17.06 U$119.1
N$117
  Top 0.254: U$121.3 33.1,15.96 34.2,17.06 U$120.1
N$118
  Top 0.254: U$122.3 29.3,15.96 30.39,17.06 U$121.1
N$119
  Top 0.254: U$123.3 25.48,15.96 26.59,17.06 U$122.1
N$120
  Top 0.254: U$124.3 21.68,15.96 22.77,17.06 U$123.1
N$121
  Top 0.254: U$125.3 17.86,15.96 18.96,17.06 U$124.1
N$122
  Top 0.254: U$126.3 14.05,15.96 15.15,17.06 U$125.1
N$123
  Top 0.254: U$127.3 10.24,15.96 11.35,17.06 U$126.1
N$124
  Top 0.254: U$128.3 6.43,15.96 7.54,17.06 U$127.1
N$125
  Top 0.254: U$129.1 6.43,19.77 7.54,20.87 U$130.3
N$126
  Top 0.254: U$130.1 10.24,19.77 11.35,20.87 U$131.3
N$127
  Top 0.254: U$131.1 14.05,19.77 15.15,20.87 U$132.3
N$128
  Top 0.254: U$132.1 17.86,19.77 18.96,20.87 U$133.3
N$129
  Top 0.254: U$133.1 21.68,19.77 22.77,20.87 U$134.3
N$130
  Top 0.254: U$134.1 25.48,19.77 26.59,20.87 U$135.3
N$131
  Top 0.254: U$135.1 29.3,19.77 30.39,20.87 U$136.3
N$132
  Top 0.254: U$136.1 33.1,19.77 34.2,20.87 U$137.3
N$133
  Top 0.254: U$137.1 36.91,19.77 38.02,20.87 U$138.3
N$134
  Top 0.254: U$138.1 40.73,19.77 41.83,20.87 U$139.3
N$135
  Top 0.254: U$139.1 44.53,19.77 45.63,20.87 U$140.3
N$136
  Top 0.254: U$140.1 48.34,19.77 49.45,20.87 U$141.3
N$137
  Top 0.254: U$141.1 52.16,19.77 53.26,20.87 U$142.3
N$138
  Top 0.254: U$142.1 55.97,19.77 57.06,20.87 U$143.3
N$139
  Top 0.254: U$143.1 59.77,19.77 60.88,20.87 U$144.3
N$140
  Top 0.254: U$144.1 63.59,19.77 64.69,20.87 U$145.3
N$141
  Top 0.254: U$145.1 67.39,19.77 68.5,20.87 U$146.3
N$142
  Top 0.254: U$146.1 71.2,19.77 72.31,20.87 U$147.3
N$143
  Top 0.254: U$147.1 75.02,19.77 76.11,20.87 U$148.3
N$144
  Top 0.254: U$148.1 78.83,19.77 79.92,20.87 U$149.3
N$145
  Top 0.254: U$149.1 82.64,19.77 83.73,20.87 U$150.3
N$146
  Top 0.254: U$150.1 86.44,19.77 87.55,20.87 U$151.3
N$147
  Top 0.254: U$151.1 90.25,19.77 91.36,20.87 U$152.3
N$148
  Top 0.254: U$152.1 94.06,19.77 95.17,20.87 U$153.3
N$149
  Top 0.254: U$153.1 97.88,19.77 98.97,20.87 U$154.3
N$150
  Top 0.254: U$154.1 101.69,19.77 102.78,20.87 U$155.3
N$151
  Top 0.254: U$155.1 105.5,19.77 106.59,20.87 U$156.3
N$152
  Top 0.254: U$156.1 109.31,19.77 110.41,20.87 U$157.3
N$153
  Top 0.254: U$157.1 113.11,19.77 114.22,20.87 U$158.3
N$154
  Top 0.254: U$158.1 116.92,19.77 118.03,20.87 U$159.3
N$155
  Top 0.254: U$159.1 120.73,19.77 121.83,20.87 U$160.3
N$156
  Top 0.254: U$162.3 120.73,23.58 121.83,24.68 U$161.1
N$157
  Top 0.254: U$163.3 116.92,23.58 118.03,24.68 U$162.1
N$158
  Top 0.254: U$164.3 113.11,23.58 114.22,24.68 U$163.1
N$159
  Top 0.254: U$165.3 109.31,23.58 110.41,24.68 U$164.1
N$160
  Top 0.254: U$166.3 105.5,23.58 106.59,24.68 U$165.1
N$161
  Top 0.254: U$167.3 101.69,23.58 102.78,24.68 U$166.1
N$162
  Top 0.254: U$168.3 97.88,23.58 98.97,24.68 U$167.1
N$163
  Top 0.254: U$169.3 94.06,23.58 95.17,24.68 U$168.1
N$164
  Top 0.254: U$170.3 90.25,23.58 91.36,24.68 U$169.1
N$165
  Top 0.254: U$171.3 86.44,23.58 87.55,24.68 U$170.1
N$166
  Top 0.254: U$172.3 82.64,23.58 83.73,24.68 U$171.1
N$167
  Top 0.254: U$173.3 78.83,23.58 79.92,24.68 U$172.1
N$168
  Top 0.254: U$174.3 75.02,23.58 76.11,24.68 U$173.1
N$169
  Top 0.254: U$175.3 71.2,23.58 72.31,24.68 U$174.1
N$170
  Top 0.254: U$176.3 67.39,23.58 68.5,24.68 U$175.1
N$171
  Top 0.254: U$177.3 63.59,23.58 64.69,24.68 U$176.1
N$172
  Top 0.254: U$178.3 59.77,23.58 60.88,24.68 U$177.1
N$173
  Top 0.254: U$179.3 55.97,23.58 57.06,24.68 U$178.1
N$174
  Top 0.254: U$180.3 52.16,23.58 53.26,24.68 U$179.1
N$175
  Top 0.254: U$181.3 48.34,23.58 49.45,24.68 U$180.1
N$176
  Top 0.254: U$182.3 44.53,23.58 45.63,24.68 U$181.1
N$177
  Top 0.254: U$183.3 40.73,23.58 41.83,24.68 U$182.1
N$178
  Top 0.254: U$184.3 36.91,23.58 38.02,24.68 U$183.1
N$179
  Top 0.254: U$185.3 33.1,23.58 34.2,24.68 U$184.1
N$180
  Top 0.254: U$186.3 29.3,23.58 30.39,24.68 U$185.1
N$181
  Top 0.254: U$187.3 25.48,23.58 26.59,24.68 U$186.1
N$182
  Top 0.254: U$188.3 21.68,23.58 22.77,24.68 U$187.1
N$183
  Top 0.254: U$189.3 17.86,23.58 18.96,24.68 U$188.1
N$184
  Top 0.254: U$190.3 14.05,23.58 15.15,24.68 U$189.1
N$185
  Top 0.254: U$191.3 10.24,23.58 11.35,24.68 U$190.1
N$186
  Top 0.254: U$192.3 6.43,23.58 7.54,24.68 U$191.1
N$187
  Top 0.254: U$193.1 6.43,27.39 7.54,28.49 U$194.3
N$188
  Top 0.254: U$194.1 10.24,27.39 11.35,28.49 U$195.3
N$189
  Top 0.254: U$195.1 14.05,27.39 15.15,28.49 U$196.3
N$190
  Top 0.254: U$196.1 17.86,27.39 18.96,28.49 U$197.3
N$191
  Top 0.254: U$197.1 21.68,27.39 22.77,28.49 U$198.3
N$192
  Top 0.254: U$198.1 25.48,27.39 26.59,28.49 U$199.3
N$193
  Top 0.254: U$199.1 29.3,27.39 30.39,28.49 U$200.3
N$194
  Top 0.254: U$200.1 33.1,27.39 34.2,28.49 U$201.3
N$195
  Top 0.254: U$201.1 36.91,27.39 38.02,28.49 U$202.3
N$196
  Top 0.254: U$202.1 40.73,27.39 41.83,28.49 U$203.3
N$197
  Top 0.254: U$203.1 44.53,27.39 45.63,28.49 U$204.3
N$198
  Top 0.254: U$204.1 48.34,27.39 49.45,28.49 U$205.3
N$199
  Top 0.254: U$205.1 52.16,27.39 53.26,28.49 U$206.3
N$200
  Top 0.254: U$206.1 55.97,27.39 57.06,28.49 U$207.3
N$201
  Top 0.254: U$207.1 59.77,27.39 60.88,28.49 U$208.3
N$202
  Top 0.254: U$208.1 63.59,27.39 64.69,28.49 U$209.3
N$203
  Top 0.254: U$209.1 67.39,27.39 68.5,28.49 U$210.3
N$204
  Top 0.254: U$210.1 71.2,27.39 72.31,28.49 U$211.3
N$205
  Top 0.254: U$211.1 75.02,27.39 76.11,28.49 U$212.3
N$206
  Top 0.254: U$212.1 78.83,27.39 79.92,28.49 U$213.3
N$207
  Top 0.254: U$213.1 82.64,27.39 83.73,28.49 U$214.3
N$208
  Top 0.254: U$214.1 86.44,27.39 87.55,28.49 U$215.3
N$209
  Top 0.254: U$215.1 90.25,27.39 91.36,28.49 U$216.3
N$210
  Top 0.254: U$216.1 94.06,27.39 95.17,28.49 U$217.3
N$211
  Top 0.254: U$217.1 97.88,27.39 98.97,28.49 U$218.3
N$212
  Top 0.254: U$218.1 101.69,27.39 102.78,28.49 U$219.3
N$213
  Top 0.254: U$219.1 105.5,27.39 106.59,28.49 U$220.3
N$214
  Top 0.254: U$220.1 109.31,27.39 110.41,28.49 U$221.3
N$215
  Top 0.254: U$221.1 113.11,27.39 114.22,28.49 U$222.3
N$216
  Top 0.254: U$222.1 116.92,27.39 118.03,28.49 U$223.3
N$217
  Top 0.254: U$223.1 120.73,27.39 121.83,28.49 U$224.3
N$218
  Top 0.254: U$226.3 120.73,31.2 121.83,32.3 U$225.1
N$219
  Top 0.254: U$227.3 116.92,31.2 118.03,32.3 U$226.1
N$220
  Top 0.254: U$228.3 113.11,31.2 114.22,32.3 U$227.1
N$221
  Top 0.254: U$229.3 109.31,31.2 110.41,32.3 U$228.1
N$222
  Top 0.254: U$230.3 105.5,31.2 106.59,32.3 U$229.1
N$223
  Top 0.254: U$231.3 101.69,31.2 102.78,32.3 U$230.1
N$224
  Top 0.254: U$232.3 97.88,31.2 98.97,32.3 U$231.1
N$225
  Top 0.254: U$233.3 94.06,31.2 95.17,32.3 U$232.1
N$226
  Top 0.254: U$234.3 90.25,31.2 91.36,32.3 U$233.1
N$227
  Top 0.254: U$235.3 86.44,31.2 87.55,32.3 U$234.1
N$228
  Top 0.254: U$236.3 82.64,31.2 83.73,32.3 U$235.1
N$229
  Top 0.254: U$237.3 78.83,31.2 79.92,32.3 U$236.1
N$230
  Top 0.254: U$238.3 75.02,31.2 76.11,32.3 U$237.1
N$231
  Top 0.254: U$239.3 71.2,31.2 72.31,32.3 U$238.1
N$232
  Top 0.254: U$240.3 67.39,31.2 68.5,32.3 U$239.1
N$233
  Top 0.254: U$241.3 63.59,31.2 64.69,32.3 U$240.1
N$234
  Top 0.254: U$242.3 59.77,31.2 60.88,32.3 U$241.1
N$235
  Top 0.254: U$243.3 55.97,31.2 57.06,32.3 U$242.1
N$236
  Top 0.254: U$244.3 52.16,31.2 53.26,32.3 U$243.1
N$237
  Top 0.254: U$245.3 48.34,31.2 49.45,32.3 U$244.1
N$238
  Top 0.254: U$246.3 44.53,31.2 45.63,32.3 U$245.1
N$239
  Top 0.254: U$247.3 40.73,31.2 41.83,32.3 U$246.1
N$240
  Top 0.254: U$248.3 36.91,31.2 38.02,32.3 U$247.1
N$241
  Top 0.254: U$249.3 33.1,31.2 34.2,32.3 U$248.1
N$242
  Top 0.254: U$250.3 29.3,31.2 30.39,32.3 U$249.1
N$243
  Top 0.254: U$251.3 25.48,31.2 26.59,32.3 U$250.1
N$244
  Top 0.254: U$252.3 21.68,31.2 22.77,32.3 U$251.1
N$245
  Top 0.254: U$253.3 17.86,31.2 18.96,32.3 U$252.1
N$246
  Top 0.254: U$254.3 14.05,31.2 15.15,32.3 U$253.1
N$247
  Top 0.254: U$255.3 9.85,31.24 10.29,31.24 11.35,32.3 U$254.1
N$248
  Top 0.254: U$256.3 6.04,31.24 6.48,31.24 7.54,32.3 U$255.1
ROW_1_OUT
  Top 0.254: U$32.1 124.8,4.53 125.09,4.83 125.09,7.87 124.63,8.34 U$33.3
ROW_2_OUT
  Top 0.254: U$65.3 4.12,13.21 3.43,13.21 3.05,12.83 3.05,9.91 3.51,9.44 U$64.1
ROW_3_OUT
  Top 0.254: U$96.1 124.8,12.15 125.09,12.45 125.09,15.62 124.76,15.96 U$97.3
ROW_4_OUT
  Top 0.254: U$129.3 4.78,20.87 5.08,20.57 5.08,17.27 4.83,17.02 4.78,17.06 U$128.1
ROW_5_OUT
  Top 0.254: U$161.3 124.15,23.62 124.71,23.62 125.09,23.24 125.09,20.07 124.8,19.77 U$160.1
ROW_6_OUT
  Top 0.254: U$193.3 4.12,28.45 3.56,28.45 3.17,28.07 3.17,25.15 3.64,24.68 U$192.1
ROW_7_OUT
  Top 0.254: U$225.3 124.76,31.2 124.97,30.99 124.97,27.56 124.8,27.39 U$224.1
VCC
  pour Top: -4.06,40.64 -4.06,-2.29 130.56,-2.29 130.56,40.64

## Text on the board
tNames: www.chaosgoo.com | GMatrix 1.0 | 2020.06